# EAGLE schematic GPIO Board Rev 2 V2 (EAGLE 9.6.2)

## Sheet 1 of 2

## Sheet 2 of 2
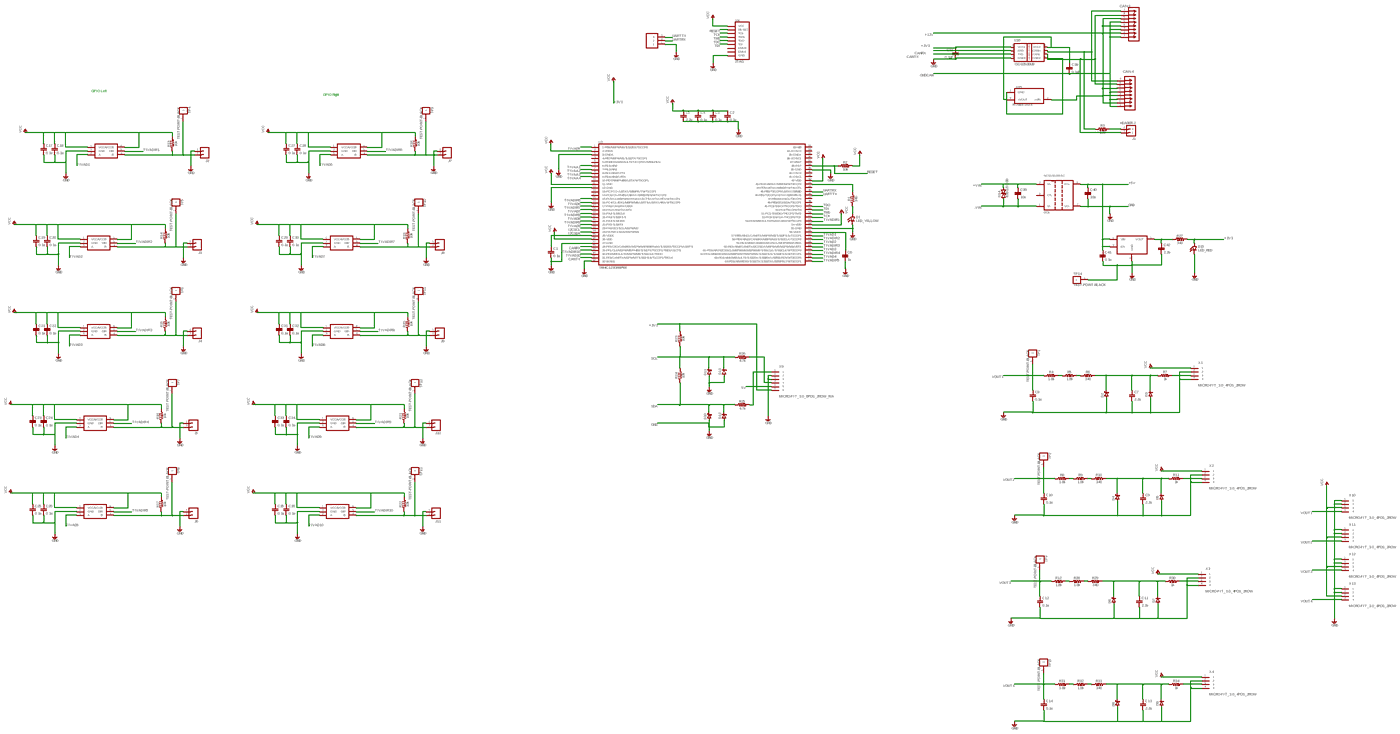
[diagram p0: schematic, sheet 2, overview]
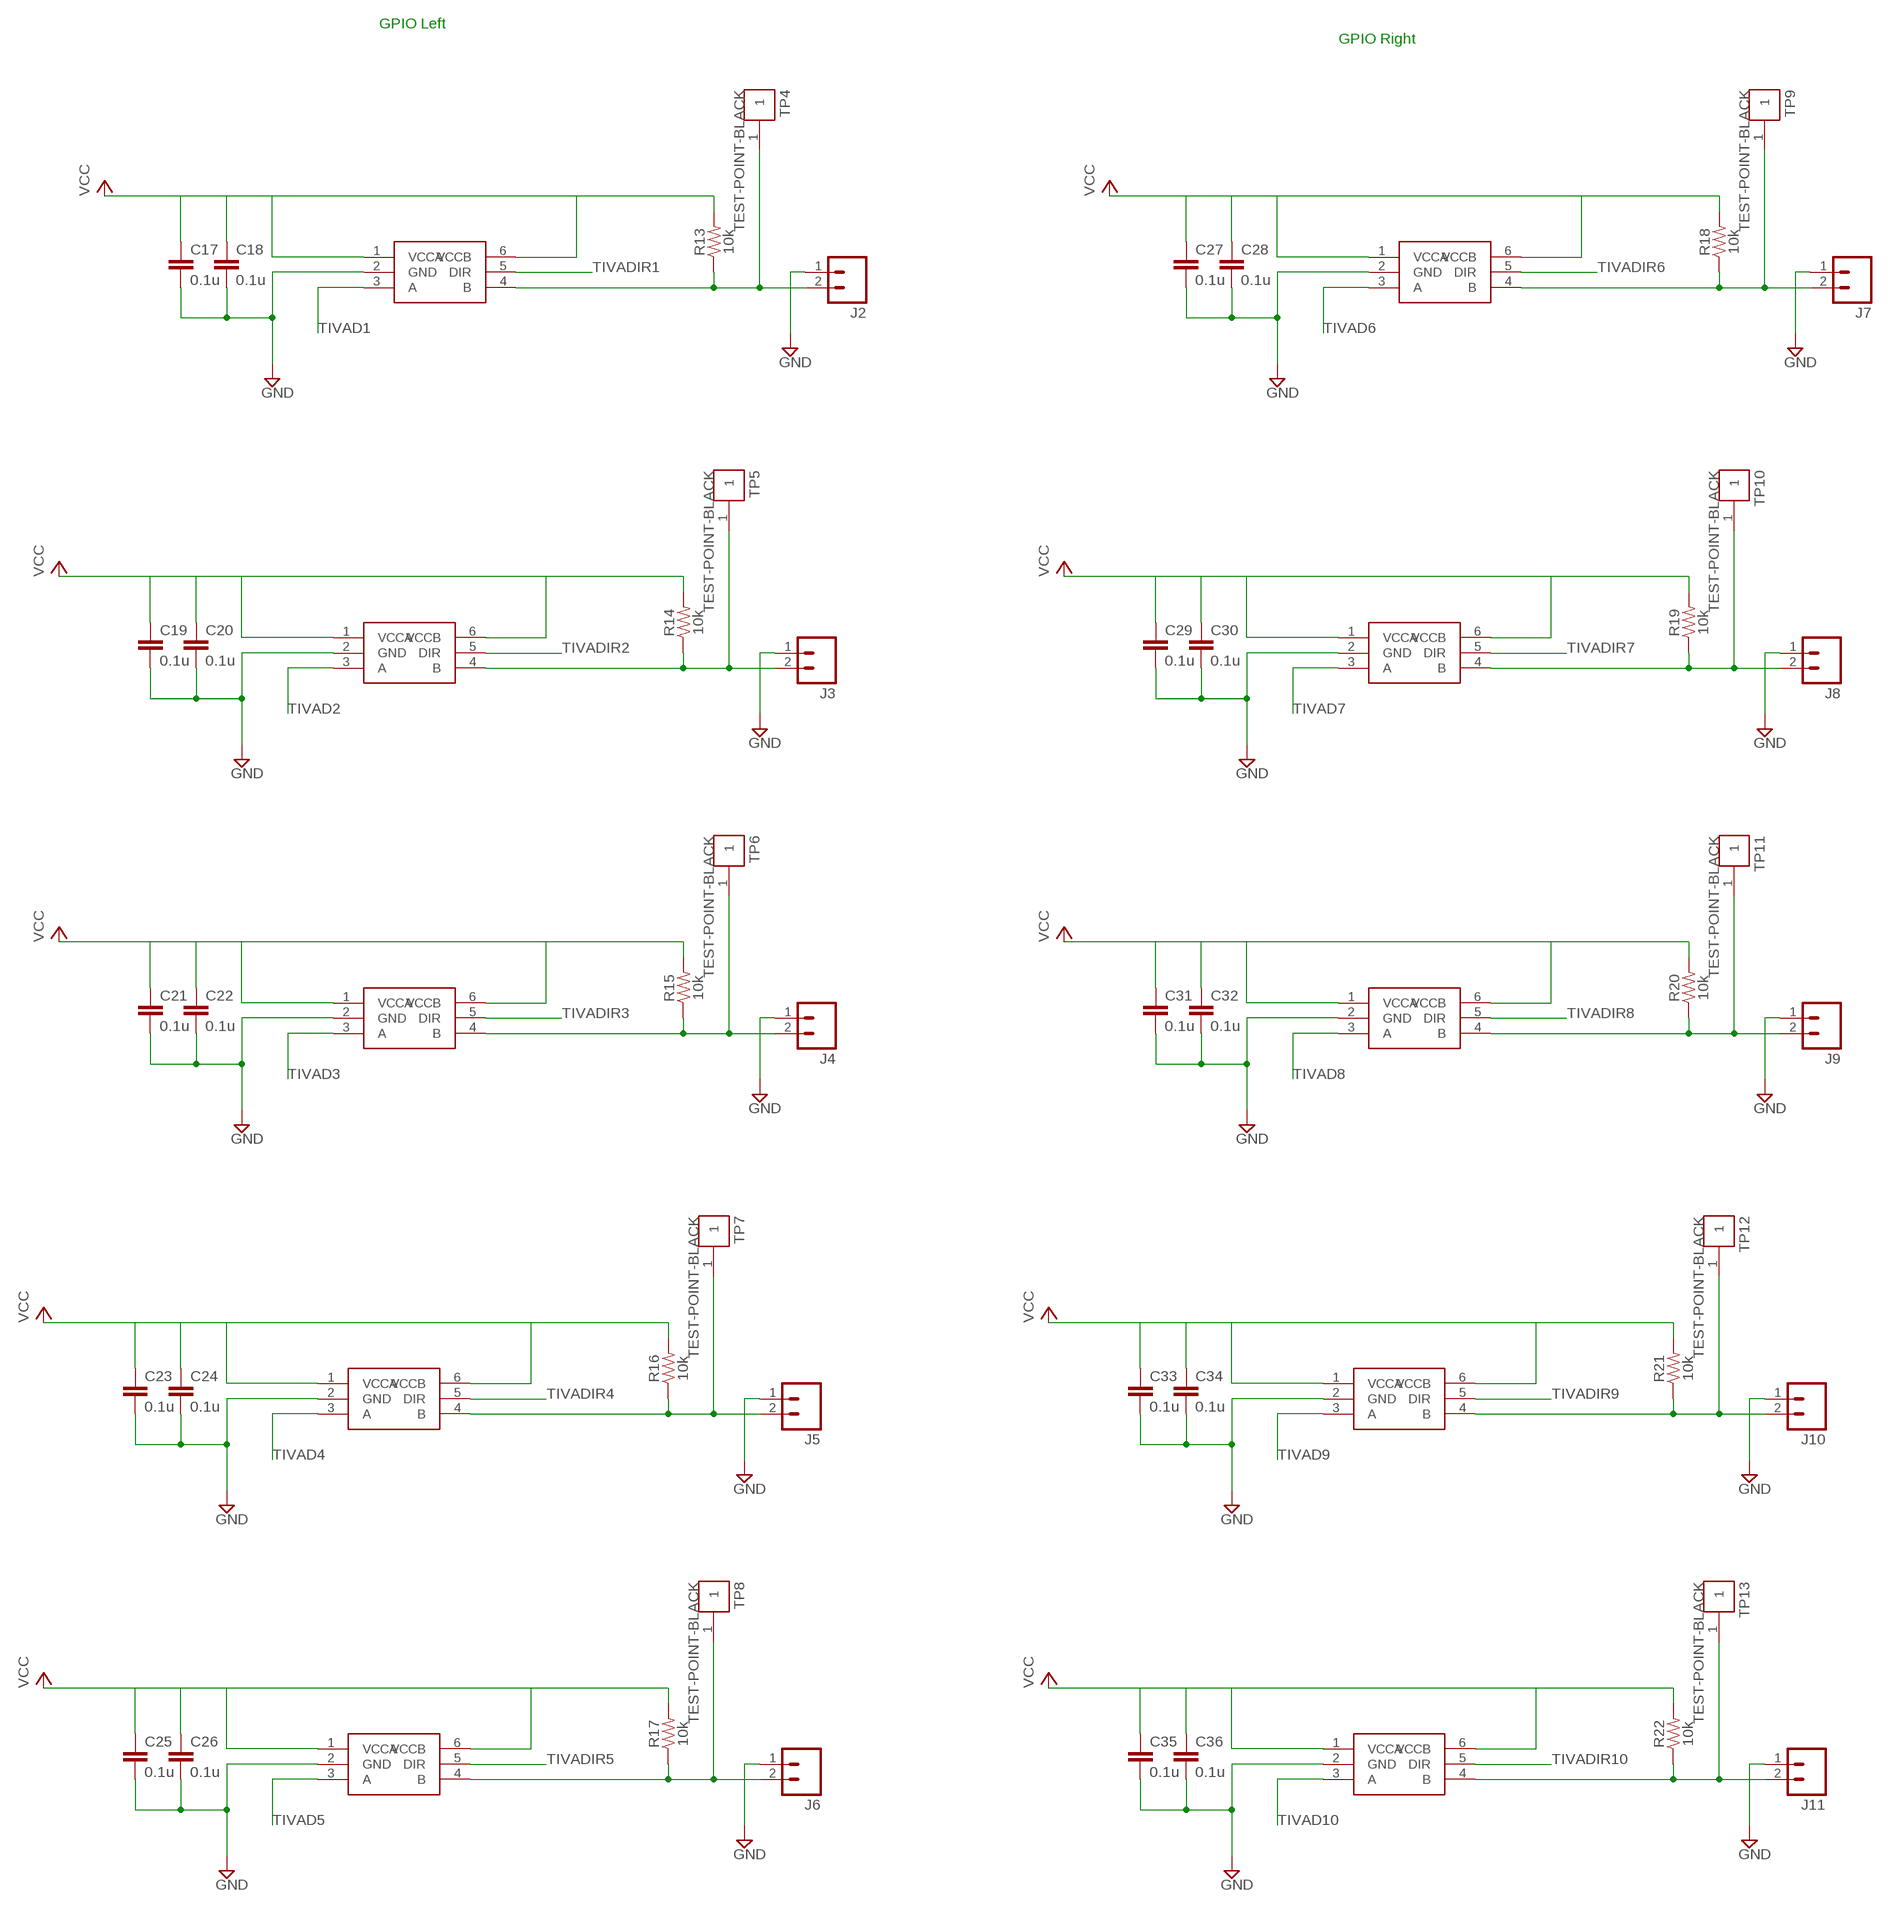
[diagram p1: schematic, sheet 2, part 1 of 4]
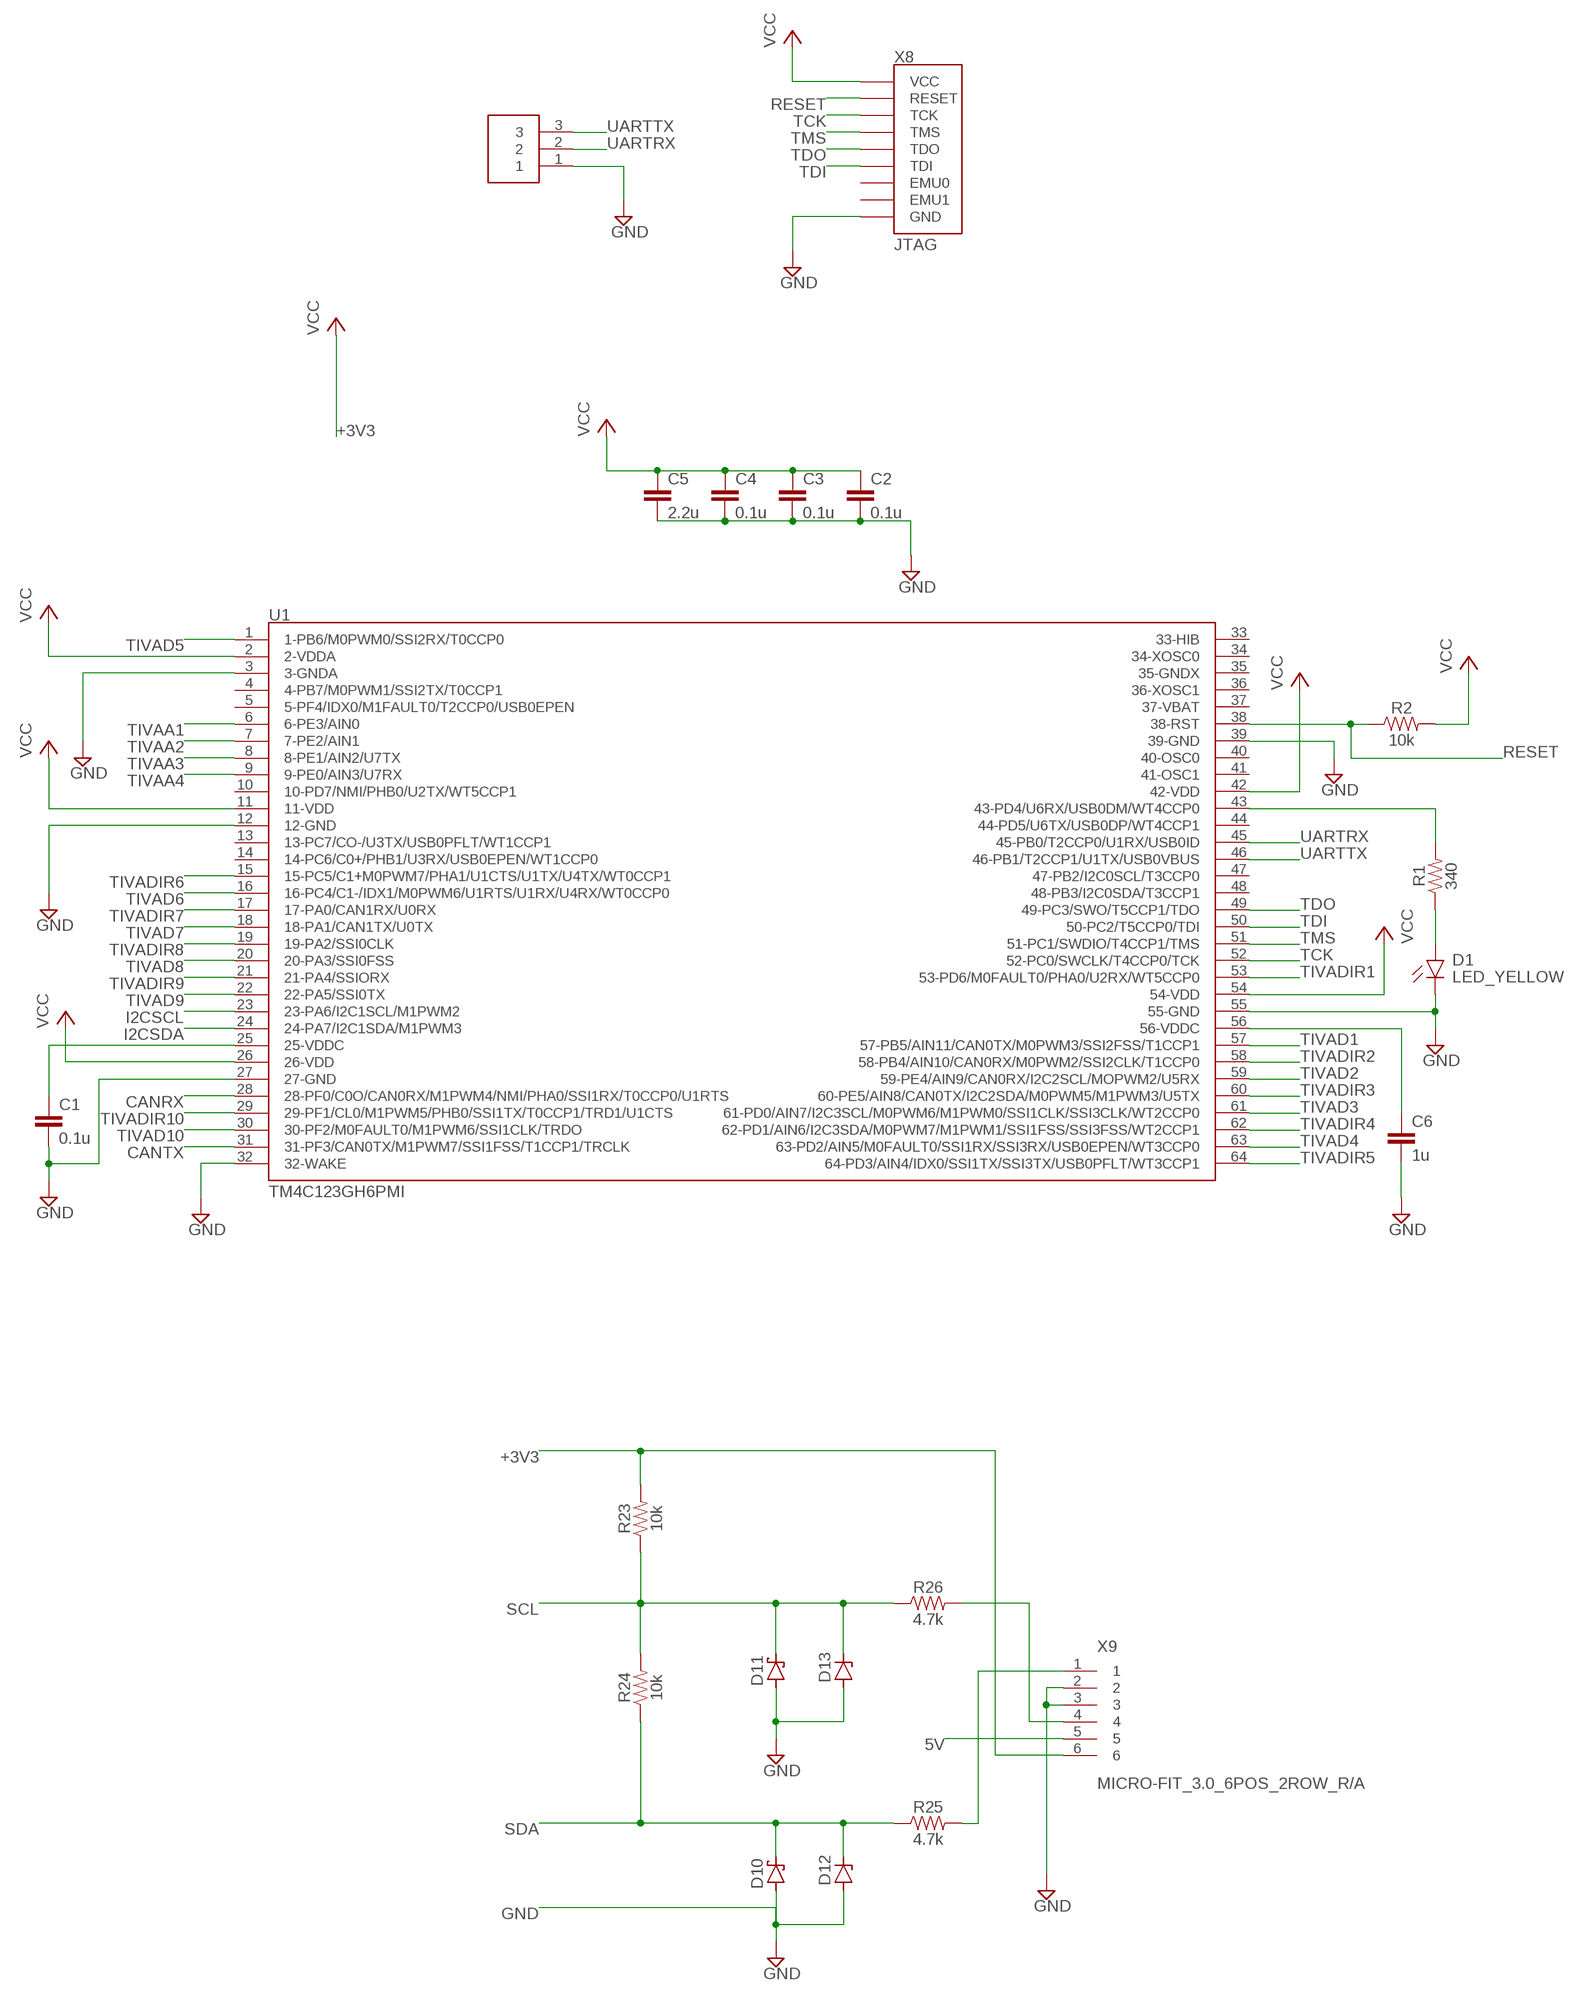
[diagram p2: schematic, sheet 2, part 2 of 4]
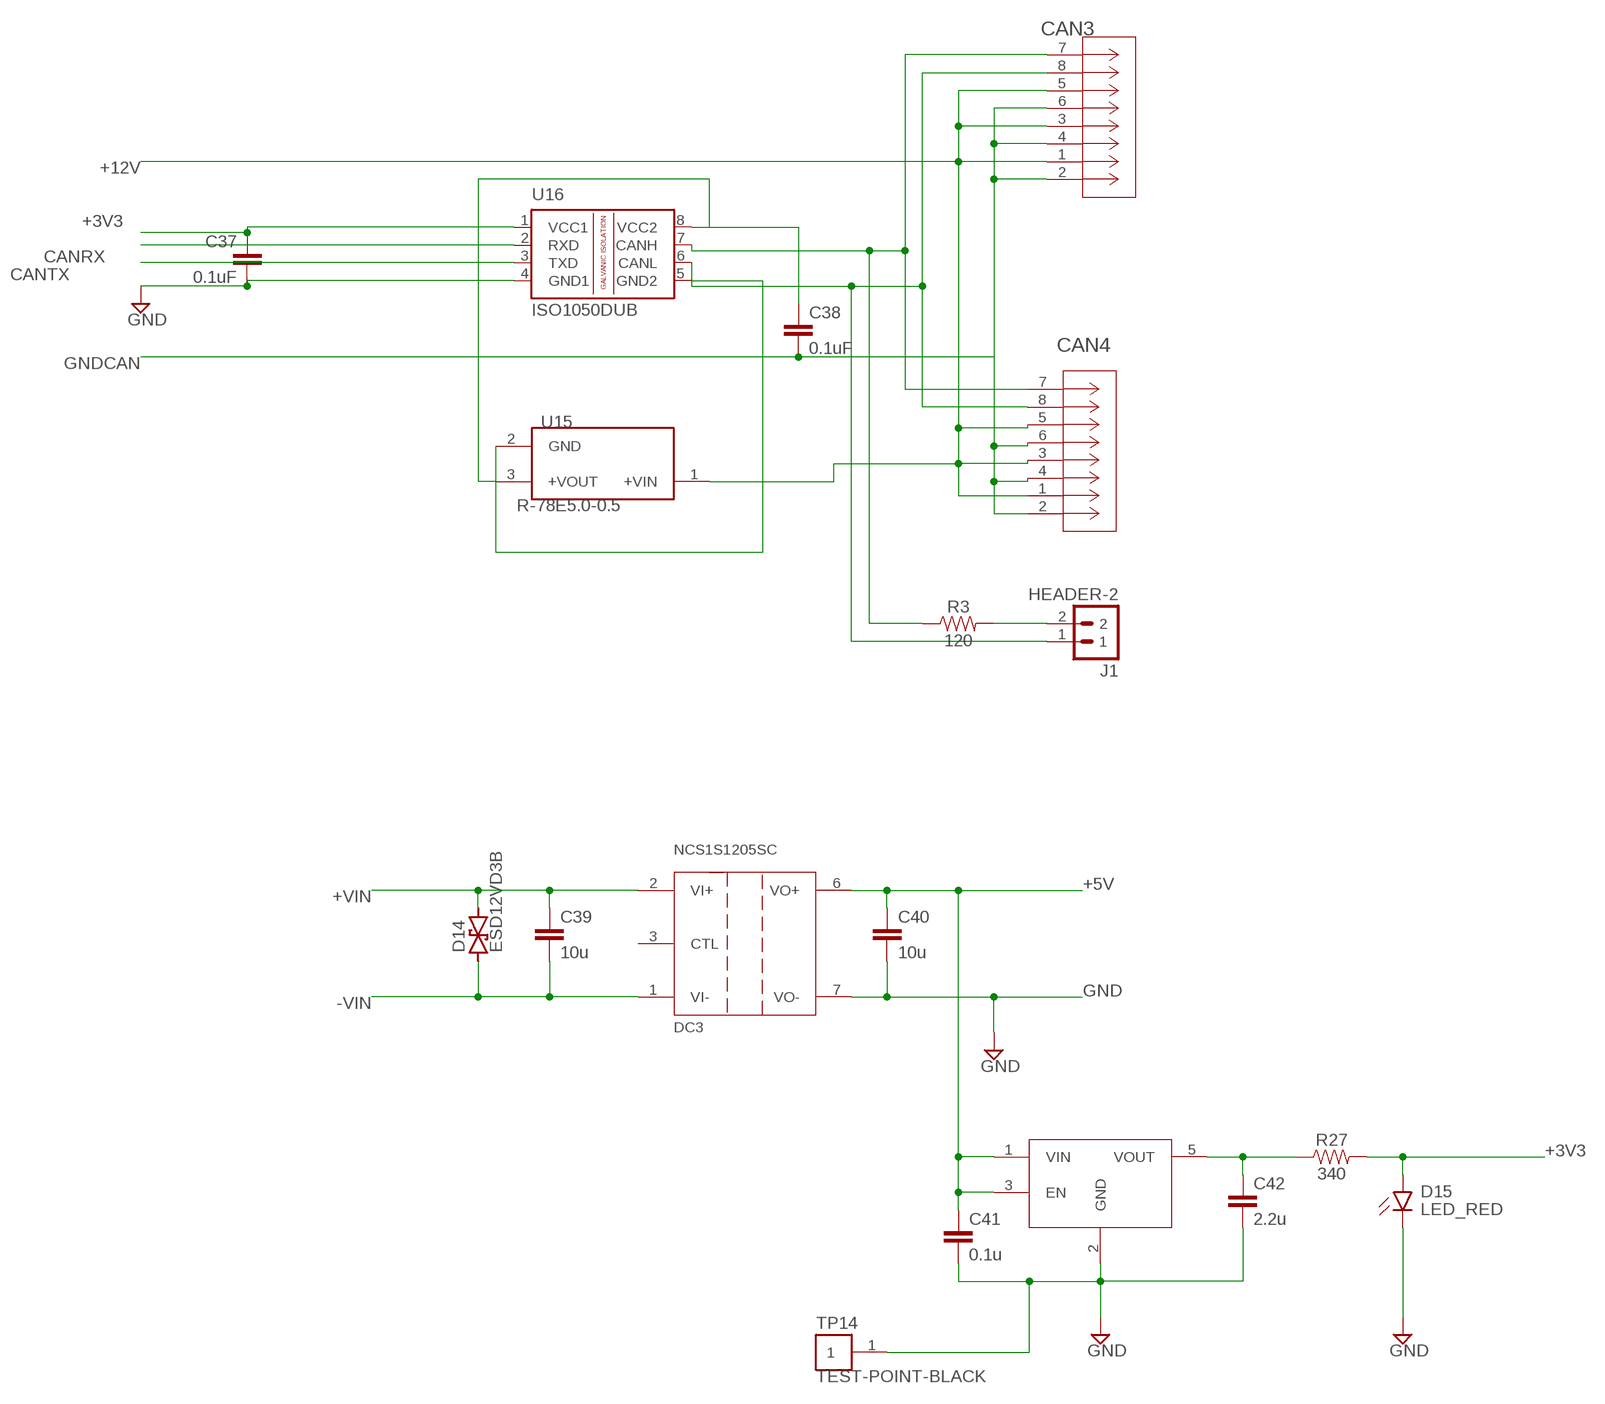
[diagram p3: schematic, sheet 2, part 3 of 4]
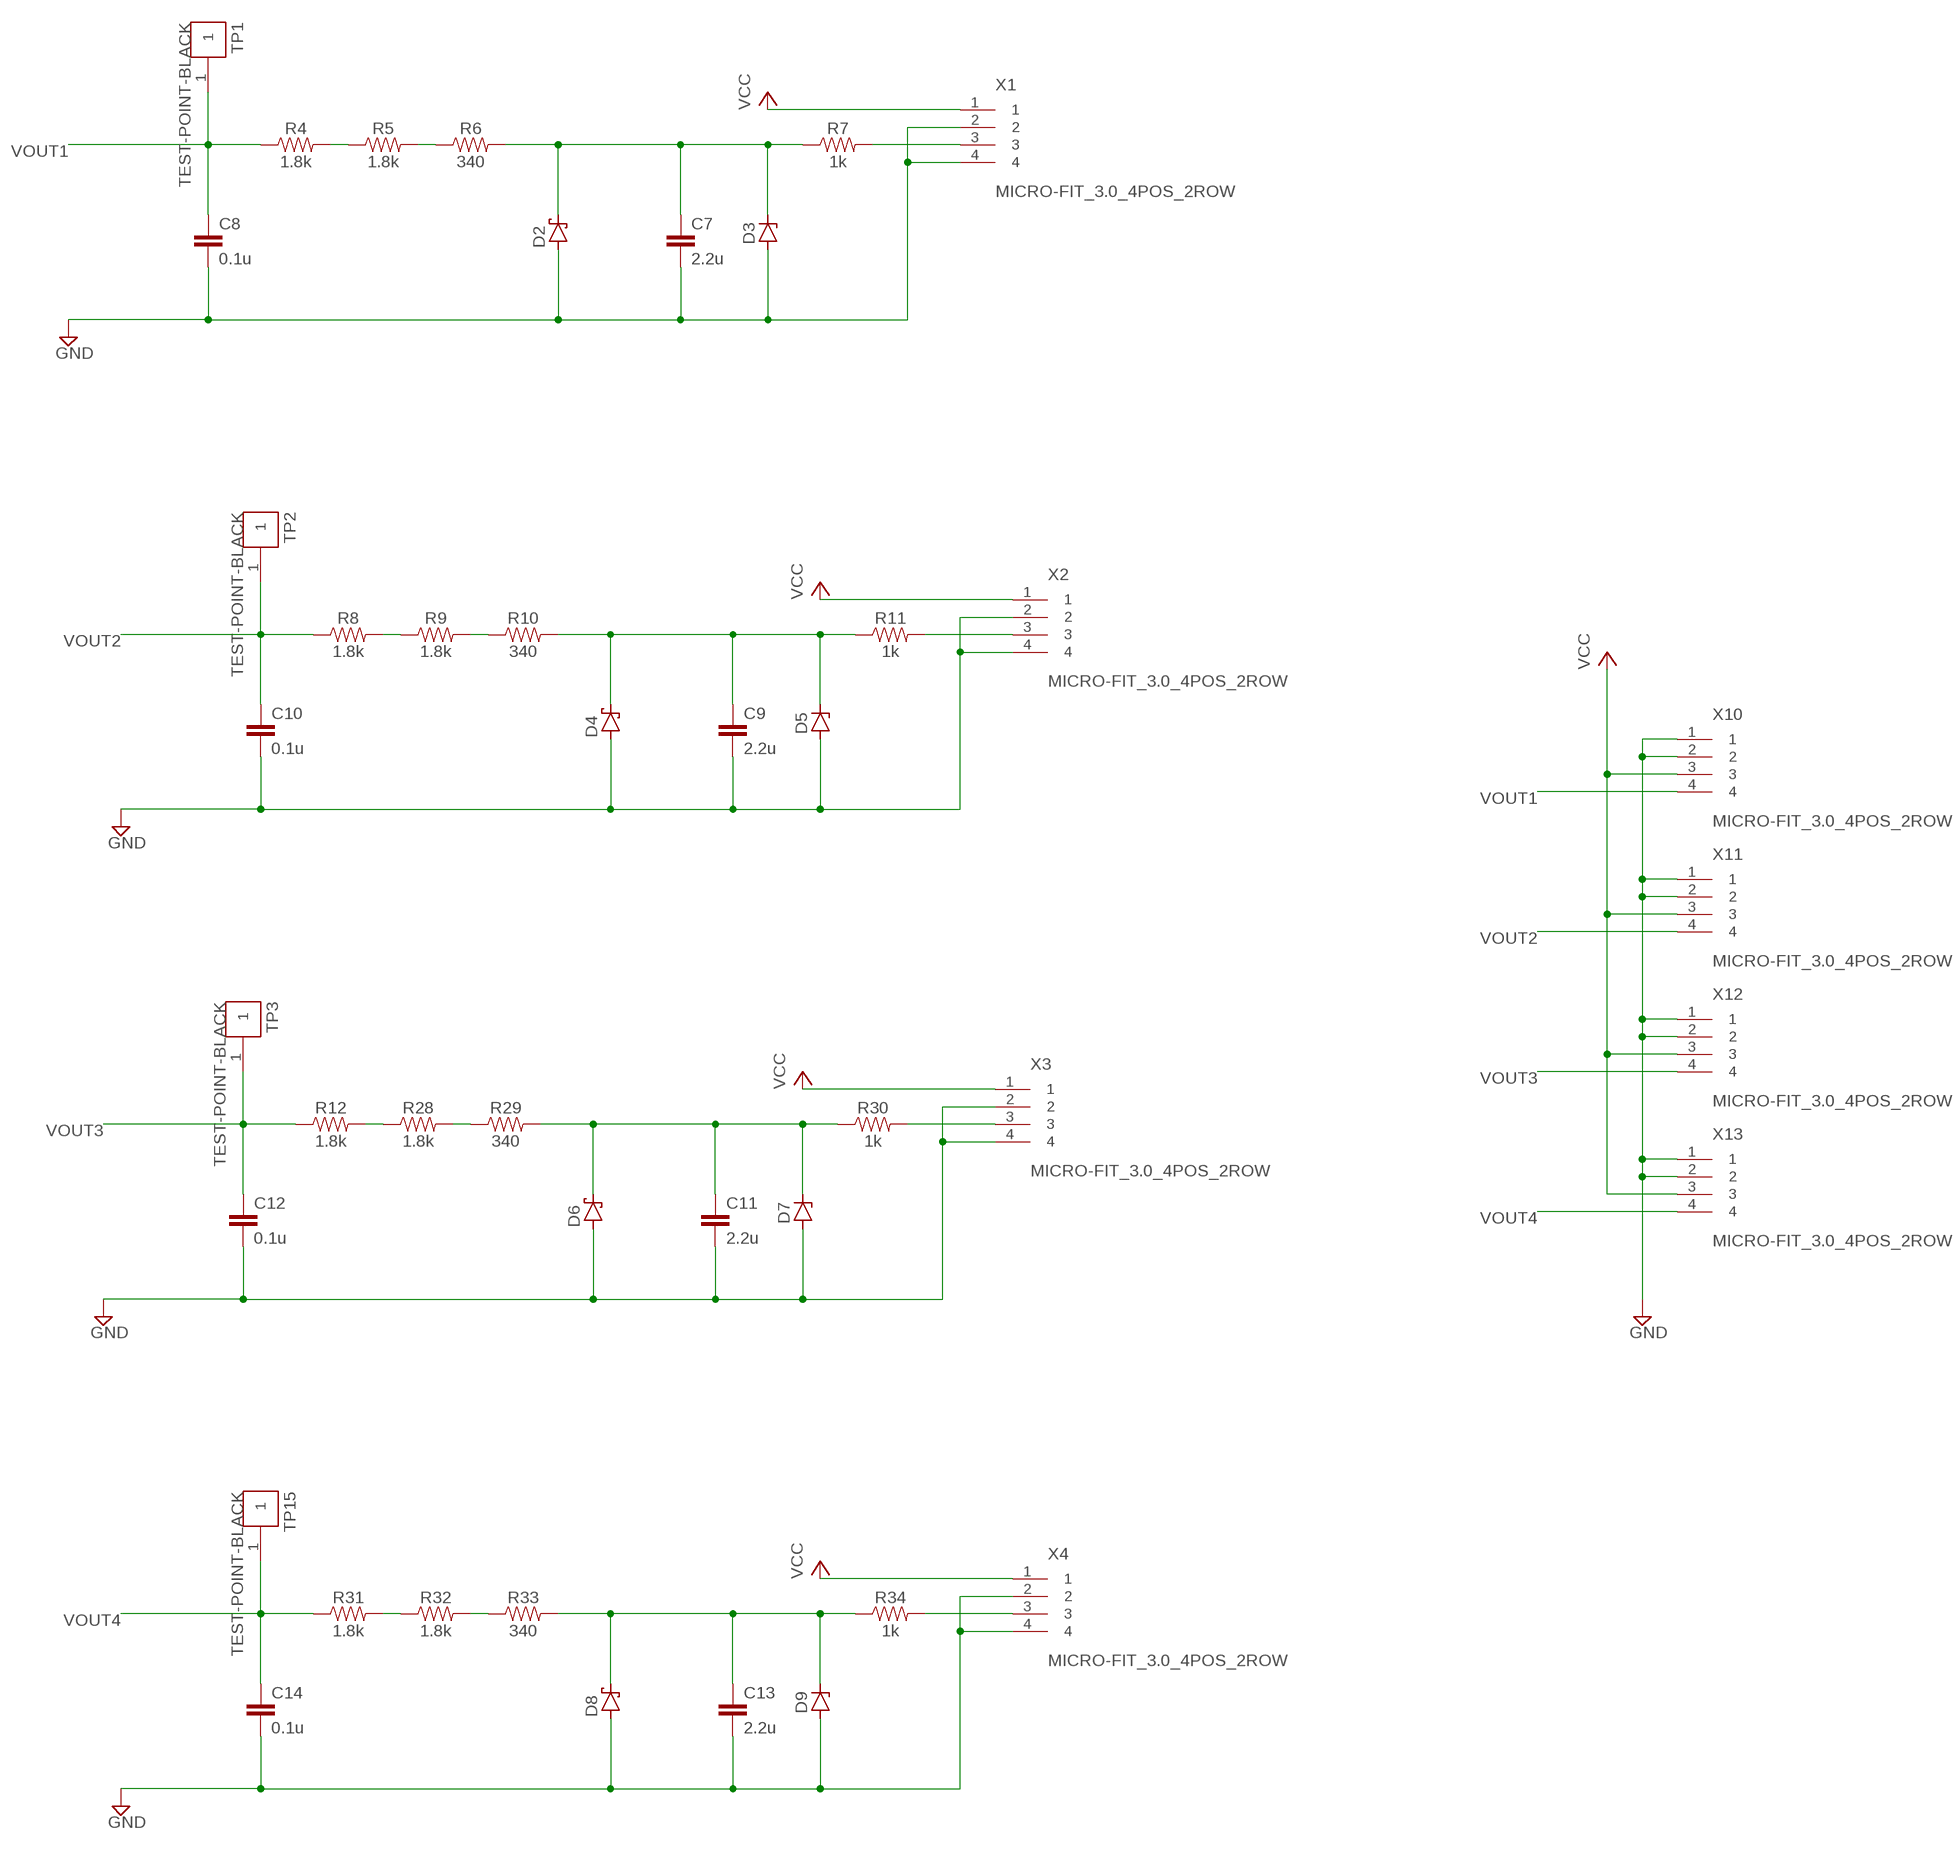
[diagram p4: schematic, sheet 2, part 4 of 4]

### Parts
C1  0.1u  CAP-0.1UF-0603-25V-X8R  [C0603]
C2  0.1u  CAP-0.1UF-0603-25V-X8R  [C0603]
C3  0.1u  CAP-0.1UF-0603-25V-X8R  [C0603]
C4  0.1u  CAP-0.1UF-0603-25V-X8R  [C0603]
C5  2.2u  CAP-2.2UF-0603-6.3V-X7R  [C0603]
C6  1u  CAP-1UF-0603-25V-X7R  [C0603]
C7  2.2u  CAP-2.2UF-0603-6.3V-X7R  [C0603]
C8  0.1u  CAP-0.1UF-0603-25V-X8R  [C0603]
C9  2.2u  CAP-2.2UF-0603-6.3V-X7R  [C0603]
C10  0.1u  CAP-0.1UF-0603-25V-X8R  [C0603]
C11  2.2u  CAP-2.2UF-0603-6.3V-X7R  [C0603]
C12  0.1u  CAP-0.1UF-0603-25V-X8R  [C0603]
C13  2.2u  CAP-2.2UF-0603-6.3V-X7R  [C0603]
C14  0.1u  CAP-0.1UF-0603-25V-X8R  [C0603]
C17  0.1u  CAP-0.1UF-0402-16V-X7R  [C0402]
C18  0.1u  CAP-0.1UF-0402-16V-X7R  [C0402]
C19  0.1u  CAP-0.1UF-0402-16V-X7R  [C0402]
C20  0.1u  CAP-0.1UF-0402-16V-X7R  [C0402]
C21  0.1u  CAP-0.1UF-0402-16V-X7R  [C0402]
C22  0.1u  CAP-0.1UF-0402-16V-X7R  [C0402]
C23  0.1u  CAP-0.1UF-0402-16V-X7R  [C0402]
C24  0.1u  CAP-0.1UF-0402-16V-X7R  [C0402]
C25  0.1u  CAP-0.1UF-0402-16V-X7R  [C0402]
C26  0.1u  CAP-0.1UF-0402-16V-X7R  [C0402]
C27  0.1u  CAP-0.1UF-0402-16V-X7R  [C0402]
C28  0.1u  CAP-0.1UF-0402-16V-X7R  [C0402]
C29  0.1u  CAP-0.1UF-0402-16V-X7R  [C0402]
C30  0.1u  CAP-0.1UF-0402-16V-X7R  [C0402]
C31  0.1u  CAP-0.1UF-0402-16V-X7R  [C0402]
C32  0.1u  CAP-0.1UF-0402-16V-X7R  [C0402]
C33  0.1u  CAP-0.1UF-0402-16V-X7R  [C0402]
C34  0.1u  CAP-0.1UF-0402-16V-X7R  [C0402]
C35  0.1u  CAP-0.1UF-0402-16V-X7R  [C0402]
C36  0.1u  CAP-0.1UF-0402-16V-X7R  [C0402]
C37  0.1uF  C5/3.5  [C5B3.5]
C38  0.1uF  C2.5/4  [C2.5-4]
C39  10u  CAP-10UF-10%-16V-X7R-1206IPC  [1206]
C40  10u  CAP-10UF-10%-16V-X7R-1206IPC  [1206]
C41  0.1u  CAP-0.1UF-0603-25V-X8R  [C0603]
C42  2.2u  CAP-2.2UF-10%-6.3V-X7R-0603IPC  [0603]
CAN3  A-2004-2-4-LPS-N-R  [CONN_4-LPS-N-R_ASM]
CAN4  A-2004-2-4-LPS-N-R  [CONN_4-LPS-N-R_ASM]
D1  LED_YELLOW  CHIP-FLAT-Y_0603-0.35MM  [LEDC1608X35N_FLAT-Y]
D2  SCHOTTKY-DIODESMD  [SMB]
D3  ZENER-DIODESMB  [SMB]
D4  SCHOTTKY-DIODESMD  [SMB]
D5  ZENER-DIODESMB  [SMB]
D6  SCHOTTKY-DIODESMD  [SMB]
D7  ZENER-DIODESMB  [SMB]
D8  SCHOTTKY-DIODESMD  [SMB]
D9  ZENER-DIODESMB  [SMB]
D10  SCHOTTKY-DIODESMD  [SMB]
D11  SCHOTTKY-DIODESMD  [SMB]
D12  ZENER-DIODESOT23  [SOT23]
D13  ZENER-DIODESOT23  [SOT23]
D14  ESD12VD3B  [SOD23]
D15  LED_RED  CHIP-FLAT-R_0805  [LEDC2012X110N_FLAT-R]
DC3  NCS1S1205SC  [7-SIP]
DC4  NCV551SN33T1G  [SOT23-5]
J1  HEADER-2  [HEADER-V-1X2]
J2  M02-JST-2-PTH-NO_SILK  [JST-2-PTH-NS]
J3  M02-JST-2-PTH-NO_SILK  [JST-2-PTH-NS]
J4  M02-JST-2-PTH-NO_SILK  [JST-2-PTH-NS]
J5  M02-JST-2-PTH-NO_SILK  [JST-2-PTH-NS]
J6  M02-JST-2-PTH-NO_SILK  [JST-2-PTH-NS]
J7  M02-JST-2-PTH-NO_SILK  [JST-2-PTH-NS]
J8  M02-JST-2-PTH-NO_SILK  [JST-2-PTH-NS]
J9  M02-JST-2-PTH-NO_SILK  [JST-2-PTH-NS]
J10  M02-JST-2-PTH-NO_SILK  [JST-2-PTH-NS]
J11  M02-JST-2-PTH-NO_SILK  [JST-2-PTH-NS]
R1  340  RES-340OHM-0603-1/10W-1%  [R0603]
R2  10k  RES-10KOHM-0603-1/10W-1%  [R0603]
R3  120  RES-120OHM-0603-1/10W-1%  [R0603]
R4  1.8k  RES-1.8KOHM-0603-1/10W-.1%  [R0603]
R5  1.8k  RES-1.8KOHM-0603-1/10W-.1%  [R0603]
R6  340  RES-340OHM-0603-1/10W-1%  [R0603]
R7  1k  RES-1KOHM-0603-1/10W-1%  [R0603]
R8  1.8k  RES-1.8KOHM-0603-1/10W-.1%  [R0603]
R9  1.8k  RES-1.8KOHM-0603-1/10W-.1%  [R0603]
R10  340  RES-340OHM-0603-1/10W-1%  [R0603]
R11  1k  RES-1KOHM-0603-1/10W-1%  [R0603]
R12  1.8k  RES-1.8KOHM-0603-1/10W-.1%  [R0603]
R13  10k  RES-10KOHM-1%-0.1W-0603IPC  [0603]
R14  10k  RES-10KOHM-1%-0.1W-0603IPC  [0603]
R15  10k  RES-10KOHM-1%-0.1W-0603IPC  [0603]
R16  10k  RES-10KOHM-1%-0.1W-0603IPC  [0603]
R17  10k  RES-10KOHM-1%-0.1W-0603IPC  [0603]
R18  10k  RES-10KOHM-1%-0.1W-0603IPC  [0603]
R19  10k  RES-10KOHM-1%-0.1W-0603IPC  [0603]
R20  10k  RES-10KOHM-1%-0.1W-0603IPC  [0603]
R21  10k  RES-10KOHM-1%-0.1W-0603IPC  [0603]
R22  10k  RES-10KOHM-1%-0.1W-0603IPC  [0603]
R23  10k  RES-10KOHM-0603-1/10W-1%  [R0603]
R24  10k  RES-10KOHM-0603-1/10W-1%  [R0603]
R25  4.7k  RES-4.7KOHM-0603-1/10W-1%  [R0603]
R26  4.7k  RES-4.7KOHM-0603-1/10W-1%  [R0603]
R27  340  RES-340OHM-0603-1/10W-1%  [R0603]
R28  1.8k  RES-1.8KOHM-0603-1/10W-.1%  [R0603]
R29  340  RES-340OHM-0603-1/10W-1%  [R0603]
R30  1k  RES-1KOHM-0603-1/10W-1%  [R0603]
R31  1.8k  RES-1.8KOHM-0603-1/10W-.1%  [R0603]
R32  1.8k  RES-1.8KOHM-0603-1/10W-.1%  [R0603]
R33  340  RES-340OHM-0603-1/10W-1%  [R0603]
R34  1k  RES-1KOHM-0603-1/10W-1%  [R0603]
TP1  TEST-POINT-BLACK  [KEYSTONE_5001_0]
TP2  TEST-POINT-BLACK  [KEYSTONE_5001_0]
TP3  TEST-POINT-BLACK  [KEYSTONE_5001_0]
TP4  TEST-POINT-BLACK  [KEYSTONE_5001_0]
TP5  TEST-POINT-BLACK  [KEYSTONE_5001_0]
TP6  TEST-POINT-BLACK  [KEYSTONE_5001_0]
TP7  TEST-POINT-BLACK  [KEYSTONE_5001_0]
TP8  TEST-POINT-BLACK  [KEYSTONE_5001_0]
TP9  TEST-POINT-BLACK  [KEYSTONE_5001_0]
TP10  TEST-POINT-BLACK  [KEYSTONE_5001_0]
TP11  TEST-POINT-BLACK  [KEYSTONE_5001_0]
TP12  TEST-POINT-BLACK  [KEYSTONE_5001_0]
TP13  TEST-POINT-BLACK  [KEYSTONE_5001_0]
TP14  TEST-POINT-BLACK  [KEYSTONE_5001_0]
TP15  TEST-POINT-BLACK  [KEYSTONE_5001_0]
U1  TM4C123GH6PMI  [S-PQFP-G64]
U5  SN74LVC1T45-Q1  [SC70]
U6  SN74LVC1T45-Q1  [SC70]
U7  SN74LVC1T45-Q1  [SC70]
U8  SN74LVC1T45-Q1  [SC70]
U9  SN74LVC1T45-Q1  [SC70]
U10  SN74LVC1T45-Q1  [SC70]
U11  SN74LVC1T45-Q1  [SC70]
U12  SN74LVC1T45-Q1  [SC70]
U13  SN74LVC1T45-Q1  [SC70]
U14  SN74LVC1T45-Q1  [SC70]
U15  R-78E5.0-0.5  [CONV_R-78E5.0-0.5]
U16  ISO1050DUB  [DUB-R-PDSO-G8]
U$2  HEADER-3  [HEADER-V-1X3]
X1  MICRO-FIT_3.0_4POS_2ROW  [0430450412]
X2  MICRO-FIT_3.0_4POS_2ROW  [0430450412]
X3  MICRO-FIT_3.0_4POS_2ROW  [0430450412]
X4  MICRO-FIT_3.0_4POS_2ROW  [0430450412]
X8  JTAG  [HEADER-V-2X7]
X9  MICRO-FIT_3.0_6POS_2ROW_R/A  [0430450600]
X10  MICRO-FIT_3.0_4POS_2ROW  [0430450412]
X11  MICRO-FIT_3.0_4POS_2ROW  [0430450412]
X12  MICRO-FIT_3.0_4POS_2ROW  [0430450412]
X13  MICRO-FIT_3.0_4POS_2ROW  [0430450412]

### Nets
5V: X9.5
+3V3: C37.2 D15.A R23.2 R27.2 U16.1(VCC1) X9.6 ; supply symbol labelled VCC
+5V: C40.1 C41.1 DC3.6(VO+) DC4.1(VIN) DC4.3(EN)
+12V: CAN3.1 CAN3.3 CAN3.5 CAN4.1 CAN4.3 CAN4.5 U15.1(+VIN)
+VIN: C39.1 D14.2 DC3.2(VI+)
-VIN: C39.2 D14.1 DC3.1(VI-)
CANRX: U1.28(28-PF0/C0O/CAN0RX/M1PWM4/NMI/PHA0/SSI1RX/T0CCP0/U1RTS) U16.2(RXD)
CANTX: U1.31(31-PF3/CAN0TX/M1PWM7/SSI1FSS/T1CCP1/TRCLK) U16.3(TXD)
GND: C1.2 C2.2 C3.2 C4.2 C5.2 C6.2 C7.2 C8.2 C9.2 C10.2 C11.2 C12.2 C13.2 C14.2 C17.2 C18.2 C19.2 C20.2 C21.2 C22.2 C23.2 C24.2 C25.2 C26.2 C27.2 C28.2 C29.2 C30.2 C31.2 C32.2 C33.2 C34.2 C35.2 C36.2 C37.1 C40.2 C41.2 C42.2 D1.C D2.A D3.A D4.A D5.A D6.A D7.A D8.A D9.A D10.A D11.A D12.1(A) D13.1(A) D15.C DC3.7(VO-) DC4.2(GND) J2.1 J3.1 J4.1 J5.1 J6.1 J7.1 J8.1 J9.1 J10.1 J11.1 TP14.1 U1.3(3-GNDA) U1.12(12-GND) U1.27(27-GND) U1.32(32-WAKE) U1.39(39-GND) U1.55(55-GND) U5.2(GND) U6.2(GND) U7.2(GND) U8.2(GND) U9.2(GND) U10.2(GND) U11.2(GND) U12.2(GND) U13.2(GND) U14.2(GND) U16.4(GND1) U$2.1 X1.2 X1.4 X2.2 X2.4 X3.2 X3.4 X4.2 X4.4 X8.4(GND) X8.6(GND) X8.8(GND) X8.10(GND) X8.12(GND) X9.2 X9.3 X10.1 X10.2 X11.1 X11.2 X12.1 X12.2 X13.1 X13.2
GNDCAN: C38.2 CAN3.2 CAN3.4 CAN3.6 CAN4.2 CAN4.4 CAN4.6
I2CSCL: U1.23(23-PA6/I2C1SCL/M1PWM2)
I2CSDA: U1.24(24-PA7/I2C1SDA/M1PWM3)
N$1: R1.2 U1.43(43-PD4/U6RX/USB0DM/WT4CCP0)
N$2: D1.A R1.1
N$3: J1.2 R3.2
N$4: CAN3.7 CAN4.7 R3.1 U16.7(CANH)
N$5: C1.1 U1.25(25-VDDC)
N$6: CAN3.8 CAN4.8 J1.1 U16.6(CANL)
N$7: R7.2 X1.3
N$8: C6.1 U1.56(56-VDDC)
N$9: C7.1 D2.C D3.C R6.2 R7.1
N$10: R5.2 R6.1
N$11: R4.2 R5.1
N$12: R11.2 X2.3
N$13: C9.1 D4.C D5.C R10.2 R11.1
N$14: R9.2 R10.1
N$15: R8.2 R9.1
N$16: R30.2 X3.3
N$17: C11.1 D6.C D7.C R29.2 R30.1
N$18: R28.2 R29.1
N$19: R12.2 R28.1
N$20: R34.2 X4.3
N$21: J2.2 R13.1 TP4.1 U5.4(B)
N$22: U5.1(VCCA)
N$23: J7.2 R18.1 TP9.1 U10.4(B)
N$24: C17.1
N$25: J3.2 R14.1 TP5.1 U6.4(B)
N$26: U6.1(VCCA)
N$27: U10.1(VCCA)
N$28: C19.1
N$29: J4.2 R15.1 TP6.1 U7.4(B)
N$30: U7.1(VCCA)
N$31: C27.1
N$32: C21.1
N$33: J5.2 R16.1 TP7.1 U8.4(B)
N$34: U8.1(VCCA)
N$35: J8.2 R19.1 TP10.1 U11.4(B)
N$36: C23.1
N$37: J6.2 R17.1 TP8.1 U9.4(B)
N$38: U9.1(VCCA)
N$39: U11.1(VCCA)
N$40: C25.1
N$41: C29.1
N$42: J9.2 R20.1 TP11.1 U12.4(B)
N$43: U12.1(VCCA)
N$44: C31.1
N$45: J10.2 R21.1 TP12.1 U13.4(B)
N$46: U13.1(VCCA)
N$47: C33.1
N$48: J11.2 R22.1 TP13.1 U14.4(B)
N$49: U14.1(VCCA)
N$50: C35.1
N$51: R26.2 X9.4
N$52: R25.2 X9.1
N$53: C13.1 D8.C D9.C R33.2 R34.1
N$54: R32.2 R33.1
N$55: U15.3(+VOUT)
N$56: U15.2(GND) U16.5(GND2)
N$57: C38.1 U16.8(VCC2)
N$58: C42.1 DC4.5(VOUT) R27.1
N$59: R31.2 R32.1
RESET: R2.1 U1.38(38-RST) X8.2(RESET)
SCL: D11.C D13.3(C) R23.1 R24.2 R26.1
SDA: D10.C D12.3(C) R24.1 R25.1
TCK: U1.52(52-PC0/SWCLK/T4CCP0/TCK) X8.9(TCK) X8.11(TCK)
TDI: U1.50(50-PC2/T5CCP0/TDI) X8.3(TDI)
TDO: U1.49(49-PC3/SWO/T5CCP1/TDO) X8.7(TDO)
TIVAA1: U1.6(6-PE3/AIN0)
TIVAA2: U1.7(7-PE2/AIN1)
TIVAA3: U1.8(8-PE1/AIN2/U7TX)
TIVAA4: U1.9(9-PE0/AIN3/U7RX)
TIVAD1: U1.57(57-PB5/AIN11/CAN0TX/M0PWM3/SSI2FSS/T1CCP1) U5.3(A)
TIVAD2: U1.59(59-PE4/AIN9/CAN0RX/I2C2SCL/MOPWM2/U5RX) U6.3(A)
TIVAD3: U1.61(61-PD0/AIN7/I2C3SCL/M0PWM6/M1PWM0/SSI1CLK/SSI3CLK/WT2CCP0) U7.3(A)
TIVAD4: U1.63(63-PD2/AIN5/M0FAULT0/SSI1RX/SSI3RX/USB0EPEN/WT3CCP0) U8.3(A)
TIVAD5: U1.1(1-PB6/M0PWM0/SSI2RX/T0CCP0) U9.3(A)
TIVAD6: U1.16(16-PC4/C1-/IDX1/M0PWM6/U1RTS/U1RX/U4RX/WT0CCP0) U10.3(A)
TIVAD7: U1.18(18-PA1/CAN1TX/U0TX) U11.3(A)
TIVAD8: U1.20(20-PA3/SSI0FSS) U12.3(A)
TIVAD9: U1.22(22-PA5/SSI0TX) U13.3(A)
TIVAD10: U1.30(30-PF2/M0FAULT0/M1PWM6/SSI1CLK/TRDO) U14.3(A)
TIVADIR1: U1.53(53-PD6/M0FAULT0/PHA0/U2RX/WT5CCP0) U5.5(DIR)
TIVADIR2: U1.58(58-PB4/AIN10/CAN0RX/M0PWM2/SSI2CLK/T1CCP0) U6.5(DIR)
TIVADIR3: U1.60(60-PE5/AIN8/CAN0TX/I2C2SDA/M0PWM5/M1PWM3/U5TX) U7.5(DIR)
TIVADIR4: U1.62(62-PD1/AIN6/I2C3SDA/M0PWM7/M1PWM1/SSI1FSS/SSI3FSS/WT2CCP1) U8.5(DIR)
TIVADIR5: U1.64(64-PD3/AIN4/IDX0/SSI1TX/SSI3TX/USB0PFLT/WT3CCP1) U9.5(DIR)
TIVADIR6: U1.15(15-PC5/C1+M0PWM7/PHA1/U1CTS/U1TX/U4TX/WT0CCP1) U10.5(DIR)
TIVADIR7: U1.17(17-PA0/CAN1RX/U0RX) U11.5(DIR)
TIVADIR8: U1.19(19-PA2/SSI0CLK) U12.5(DIR)
TIVADIR9: U1.21(21-PA4/SSIORX) U13.5(DIR)
TIVADIR10: U1.29(29-PF1/CL0/M1PWM5/PHB0/SSI1TX/T0CCP1/TRD1/U1CTS) U14.5(DIR)
TMS: U1.51(51-PC1/SWDIO/T4CCP1/TMS) X8.1(TMS)
UARTRX: U1.45(45-PB0/T2CCP0/U1RX/USB0ID) U$2.2
UARTTX: U1.46(46-PB1/T2CCP1/U1TX/USB0VBUS) U$2.3
VCC: C2.1 C3.1 C4.1 C5.1 C18.1 C20.1 C22.1 C24.1 C26.1 C28.1 C30.1 C32.1 C34.1 C36.1 R2.2 R13.2 R14.2 R15.2 R16.2 R17.2 R18.2 R19.2 R20.2 R21.2 R22.2 U1.2(2-VDDA) U1.11(11-VDD) U1.26(26-VDD) U1.42(42-VDD) U1.54(54-VDD) U5.6(VCCB) U6.6(VCCB) U7.6(VCCB) U8.6(VCCB) U9.6(VCCB) U10.6(VCCB) U11.6(VCCB) U12.6(VCCB) U13.6(VCCB) U14.6(VCCB) X1.1 X2.1 X3.1 X4.1 X8.5(VCC) X10.3 X11.3 X12.3 X13.3
VOUT1: C8.1 R4.1 TP1.1 X10.4
VOUT2: C10.1 R8.1 TP2.1 X11.4
VOUT3: C12.1 R12.1 TP3.1 X12.4
VOUT4: C14.1 R31.1 TP15.1 X13.4
Unconnected: DC3.3(CTL) U1.4(4-PB7/M0PWM1/SSI2TX/T0CCP1) U1.5(5-PF4/IDX0/M1FAULT0/T2CCP0/USB0EPEN) U1.10(10-PD7/NMI/PHB0/U2TX/WT5CCP1) U1.13(13-PC7/CO-/U3TX/USB0PFLT/WT1CCP1) U1.14(14-PC6/C0+/PHB1/U3RX/USB0EPEN/WT1CCP0) U1.33(33-HIB) U1.34(34-XOSC0) U1.35(35-GNDX) U1.36(36-XOSC1) U1.37(37-VBAT) U1.40(40-OSC0) U1.41(41-OSC1) U1.44(44-PD5/U6TX/USB0DP/WT4CCP1) U1.47(47-PB2/I2C0SCL/T3CCP0) U1.48(48-PB3/I2C0SDA/T3CCP1) X8.13(EMU0) X8.14(EMU1)

### Notes on the sheet
- GPIO Left
- GPIO Right

## Library data of the parts
C1-C4 C8 C10 C12 C14 C41 = gtsr-passive:CAP-0.1UF: 0.1µF Ceramic Capacitor; MANUFACTURER: Murata Electronics; MFPN: GCM188R91E104KA37D; SUPPLIER: Digi-Key; SUPPLIER_PN: 490-14359-1-ND
C5 C7 C9 C11 C13 = gtsr-passive:CAP-2.2UF: 2.2µF Ceramic Capacitor; AUTOMOTIVE: Yes; MANUFACTURER: Murata; MFPN: GCM188R70J225KE22J; SUPPLIER: Digikey; SUPPLIER_PN: 490-14529-1-ND
C6 = gtsr-passive:CAP-1UF: 1µF Ceramic Capacitor; MANUFACTURER: Murata; MFPN: GCM188R71E105KA64D; SUPPLIER: Digikey; SUPPLIER_PN: 490-10673-1-ND
C17-C36 = gtsr-passive:CAP-0.1UF: 0.1µF Ceramic Capacitor; MANUFACTURER: Murata; MFPN: GCM155R71C104KA55D; SUPPLIER: Digikey; SUPPLIER_PN: 490-4759-1-ND
C37 C38 = capacitor-wima:C: CAPACITOR naming: grid - package width
C39 C40 = gtsr-passive:CAP-10UF: 10µF Ceramic Capacitor; MFR: Murata Electronics; MPN: GCM31CR71C106KA64K; SPN: 490-14746-1-ND; SPR: Digi-Key
C42 = gtsr-passive:CAP-2.2UF: 2.2µF Ceramic Capacitor; MFR: Murata Electronics; MPN: GCM188R70J225KE22D; SPN: 490-5316-1-ND; SPR: Digi-Key
CAN3 CAN4 = A-2004-2-4-LPS-N-R:A-2004-2-4-LPS-N-R; COPYRIGHT: Copyright (C) 2021 Ultra Librarian. All rights reserved.; DIGI-KEY_PART_NUMBER_1: AE10387-ND; MANUFACTURER_PART_NUMBER: A-2004-2-4-LPS-N-R; MFR_NAME: Assmann
D1 = LED:CHIP-FLAT-Y; CATEGORY: LED; COLOR: YELLOW; DESCRIPTION: CHIP LED FLAT; SUB-CATEGORY: CHIP; TYPE: FLAT_TOP
D2 D4 D6 D8 D10 D11 = diode:SCHOTTKY-DIODE: Schottky Diode
D3 D5 D7 D9 D12 D13 = diode:ZENER-DIODE: Z-Diode
D14 = gtsr-diode:ESD12VD3B; MANUFACTURER: Micro Commercial Co; MFPN: ESD12VD3B-TP; SUPPLIER: Digikey; SUPPLIER_PN: ESD12VD3B-TPMSCT-ND
D15 = LED:CHIP-FLAT-R; CATEGORY: LED; COLOR: RED; DESCRIPTION: CHIP LED FLAT; SUB-CATEGORY: CHIP; TYPE: FLAT_TOP
DC3 = gtsr-power-supply:NCS1S1205SC: Isolated Module DC DC Converter 1 Output 5V 200mA 4.5V - 18V Input; MANUFACTURER: Murata; MFPN: NCS1S1205SC; SUPPLIER: Digikey; SUPPLIER_PN: 811-2945-ND
DC4 = gtsr-power-supply:NCV551; AUTOMOTIVE: Yes; MANUFACTURER: ON Semiconductor; MFPN: NCV551SN33T1G; SUPPLIER: Digikey; SUPPLIER_PN: NCV551SN33T1GOSCT-ND; VOUT: 3.3
J1 = gtsr-connector:HEADER-2; MANUFACTURER: Molex; MFPN: 0022284027; SUPPLIER: Digikey; SUPPLIER_PN: WM24201-ND
J2-J11 = gtsr-connector:M02: Standard 2-pin 0.1" header. Use with - straight break away headers ( PRT-00116) - right angle break away headers (PRT-00553) - swiss pins (PRT-00743) - machine pins (PRT-00117) - female headers (PRT-00115) Molex polarized connector foot print use with: PRT-08233 with associated crimp pins and housings. 2.54_SCREWTERM for use with PRT-10571. 3.5mm Screw Terminal footprints for PRT-08084 5mm Screw Terminal footprints for use with PRT-08432 Copied from SparkFun Connector
R1 R6 R10 R27 R29 R33 = gtsr-passive:RES-340OHM; MANUFACTURER: Panasonic; MFPN: ERJ-3EKF3400V; SUPPLIER: Digikey; SUPPLIER_PN: P340HCT-ND
R2 R23 R24 = gtsr-passive:RES-10KOHM; MANUFACTURER: Panasonic; MFPN: ERJ-3EKF1002V; SUPPLIER: Digikey; SUPPLIER_PN: P10.0KHCT-ND
R3 = gtsr-passive:RES-120OHM; MANUFACTURER: Panasonic; MFPN: ERJ-3EKF1200V; SUPPLIER: Digikey; SUPPLIER_PN: P120HTR-ND
R4 R5 R8 R9 R12 R28 R31 R32 = gtsr-passive:RES-1.8KOHM; AUTOMOTIVE: Yes; MANUFACTURER: Panasonic; MFPN: ERA-3AEB182V; RESISTANCE: 1.8k; SUPPLIER: Digikey; SUPPLIER_PN: P1.8KDBCT-ND
R7 R11 R30 R34 = gtsr-passive:RES-1KOHM; MANUFACTURER: Panasonic; MFPN: ERJ-3EKF1001V; SUPPLIER: Digikey; SUPPLIER_PN: P1.00KHCT-ND
R13-R22 = gtsr-passive:RES-10KOHM; MFR: Panasonic Electronic Components; MPN: ERJ-3EKF1002V; SPN: P10.0KHCT-ND; SPR: Digi-Key
R25 R26 = gtsr-passive:RES-4.7KOHM; MANUFACTURER: Panasonic Electronic Components; MFPN: ERJ-3EKF4701V; SUPPLIER: Digi-Key; SUPPLIER_PN: P4.70KHCT-ND
TP1-TP15 = gtsr-connector:TEST-POINT: BLACK THRU-HOLE MOUNT TEST POINT; MANUFACTURER: Keystone Electronics; MFPN: 5001; SUPPLIER: Digikey; SUPPLIER_PN: 36-5001-ND
U1 = gtsr-digital-ic:TM4C1; MFR: Texas Instruments; MPN: TM4C123GH6PMI; SPN: 296-35848-ND; SPR: Digi-Key
U5-U14 = gtsr-digital-ic:SN74LVC1T45-Q1; MANUFACTURER: Texas Instruments; MFPN: SN74LVC1T45QDCKRQ1; SUPPLIER: Digikey; SUPPLIER_PN: 296-39212-1-ND
U15 = R-78E5.0-0.5:R-78E5.0-0.5: 0.5 Amp SIP3 Single Output; DESCRIPTION: Switching regulator module - DC/DC converter . Single Output. 7.0V to 28.0V input voltage range and 5 V output voltage range; DIGI-KEY_PART_NUMBER: 945-1648-5-ND; MF: Recom Power; MP: R-78E5.0-0.5; PACKAGE: SIP-3 Recom Power; PURCHASE-URL: https://pricing.snapeda.com/search/part/R-78E5.0-0.5/?ref=eda
U16 = texas:ISO1050: ISOLATED CAN TRANSCEIVER Source: http://focus.ti.com/lit/ds/symlink/iso1050.pdf; MPN: ISO1050DUBR; OC_FARNELL: 1755712; OC_NEWARK: 14R9899
U$2 = gtsr-connector:HEADER-3; MANUFACTURER: Molex; MFPN: 0901200763; SUPPLIER: Digikey; SUPPLIER_PN: WM8085-ND
X1-X4 X10-X13 = gtsr-connector:MICRO-FIT_3.0_4POS; MANUFACTURER: Molex; MFPN: 0430450412; SUPPLIER: Digi-Key; SUPPLIER_PN: WM1790-ND
X8 = gtsr-connector:JTAG; MANUFACTURER: TE Connectivity; MFPN: 2-1761603-5; SUPPLIER: Digikey; SUPPLIER_PN: A97471-ND
X9 = gtsr-connector:MICRO-FIT_3.0_6POS; MANUFACTURER: Molex; MFPN: 0430450600; SUPPLIER: Digi-Key; SUPPLIER_PN: WM1815-ND